# EAGLE schematic Nano-CC-EL_0v6.1_ENP252-17 (EAGLE 7.3.0)
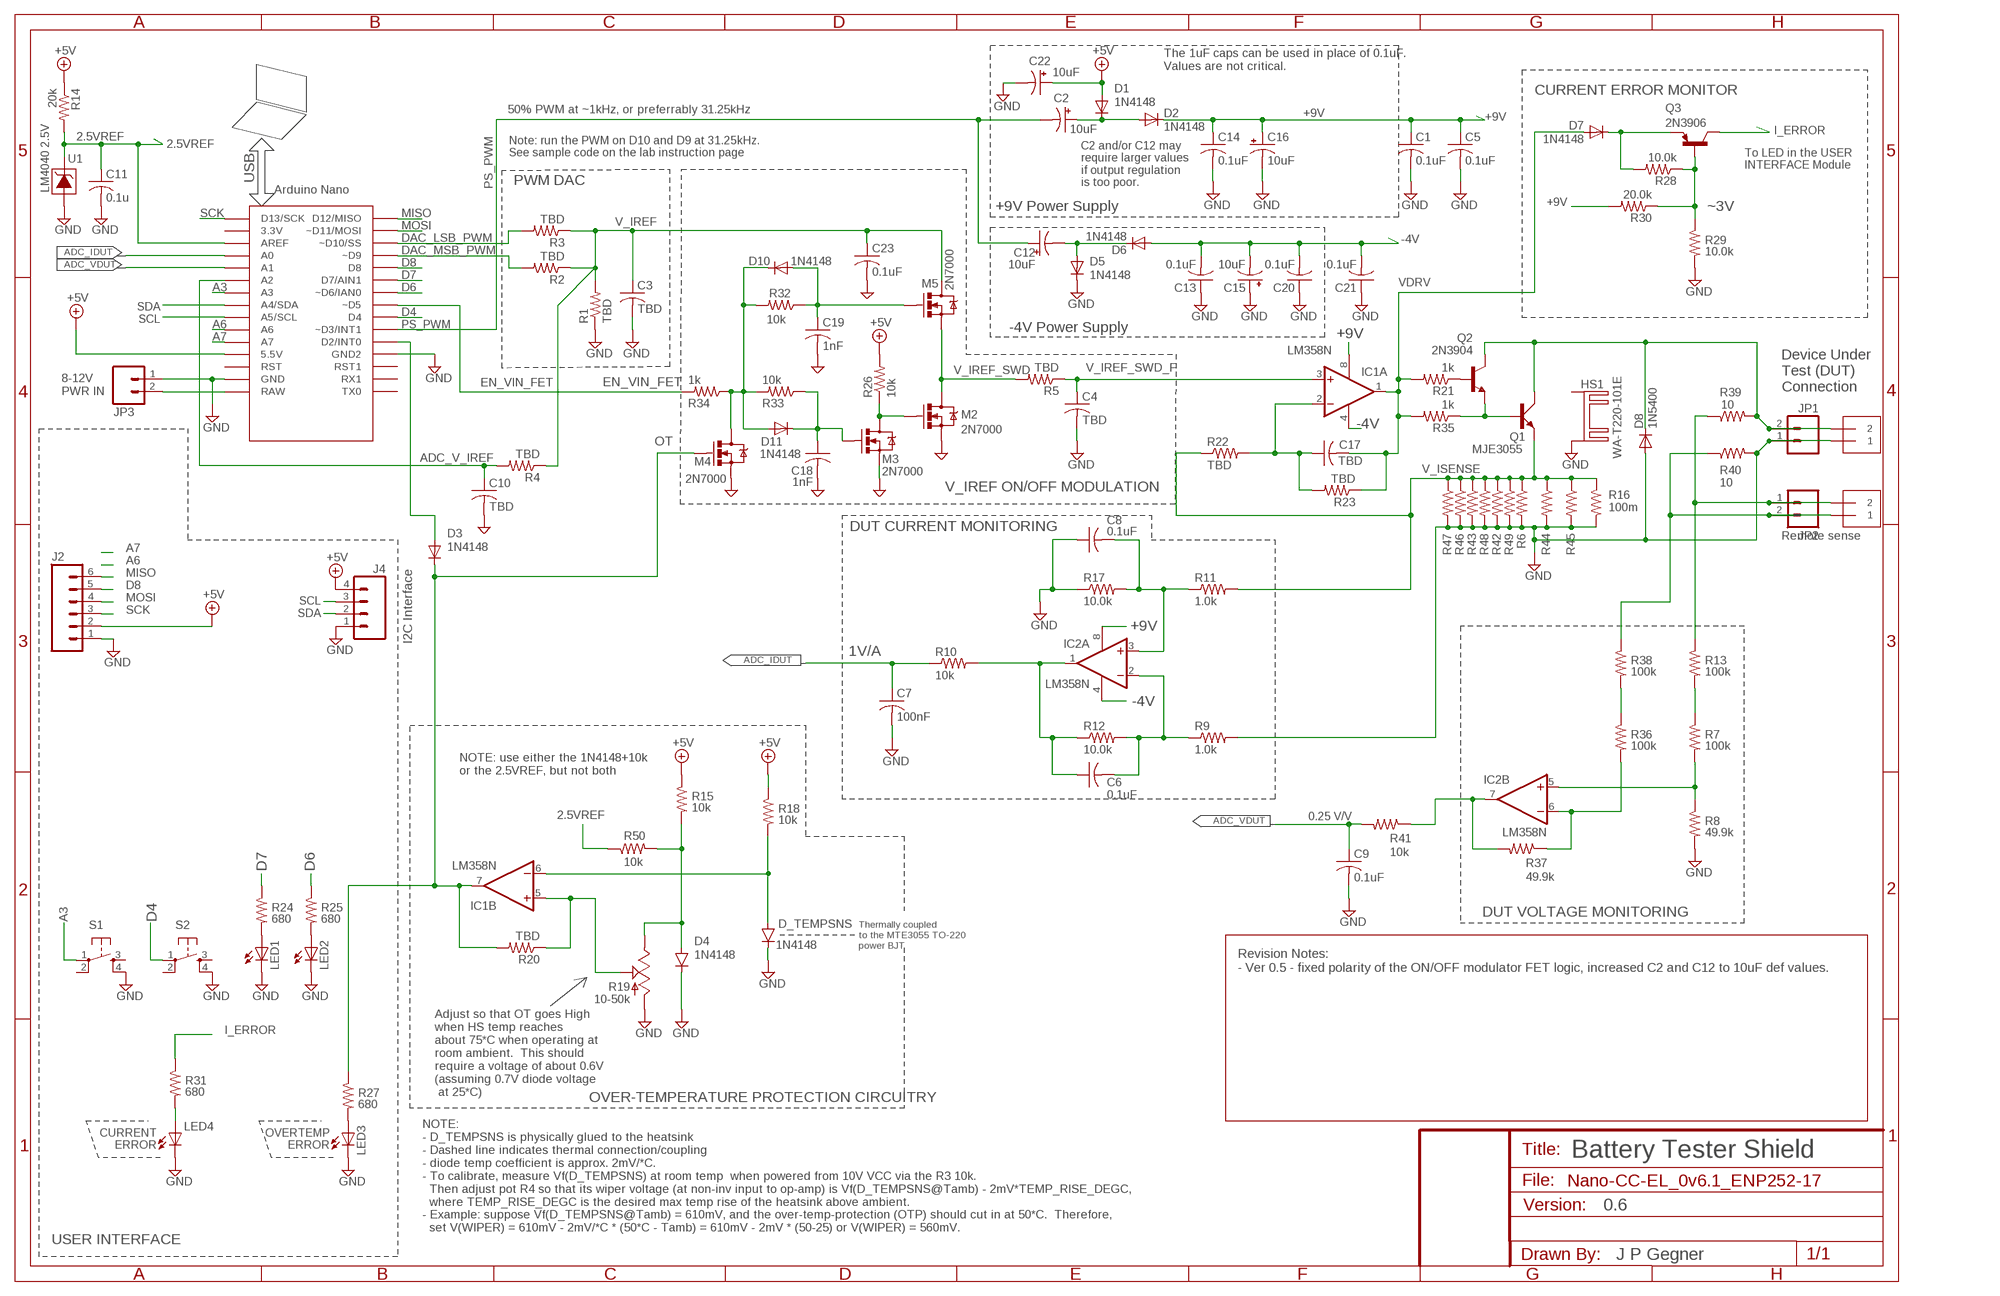
[diagram p0: schematic, sheet 1]

## Parts
C1  0.1uF  C-US025-025X050  [C025-025X050]
C2  10uF  CPOL-USE5-5  [E5-5]
C3  TBD  C-US025-025X050  [C025-025X050]
C4  TBD  C-US025-025X050  [C025-025X050]
C5  0.1uF  C-US025-025X050  [C025-025X050]
C6  0.1uF  C-US025-025X050  [C025-025X050]
C7  100nF  C-US025-024X044  [C025-024X044]
C8  0.1uF  C-US025-025X050  [C025-025X050]
C9  0.1uF  C-US025-025X050  [C025-025X050]
C10  TBD  C-US025-025X050  [C025-025X050]
C11  0.1u  C-US025-025X050  [C025-025X050]
C12  10uF  CPOL-USE5-5  [E5-5]
C13  0.1uF  C-US025-025X050  [C025-025X050]
C14  0.1uF  C-US025-025X050  [C025-025X050]
C15  10uF  CPOL-USE5-5  [E5-5]
C16  10uF  CPOL-USE5-5  [E5-5]
C17  TBD  C-US025-025X050  [C025-025X050]
C18  1nF  C-US025-025X050  [C025-025X050]
C19  1nF  C-US025-025X050  [C025-025X050]
C20  0.1uF  C-US025-025X050  [C025-025X050]
C21  0.1uF  C-US025-025X050  [C025-025X050]
C22  10uF  CPOL-USE5-5  [E5-5]
C23  0.1uF  C-US025-025X050  [C025-025X050]
D1  1N4148  [0207/2V-D]
D2  1N4148  [0207/2V-D]
D3  1N4148  [0207/2V-D]
D4  1N4148  [0207/2V-D]
D5  1N4148  [0207/2V-D]
D6  1N4148  [0207/2V-D]
D7  1N4148  [0207/2V-D]
D8  1N5400  [DO201-15]
D10  1N4148  [0207/2V-D]
D11  1N4148  [0207/2V-D]
D_TEMPSNS  1N4148  [0207/2V-D]
HS1  WA-T220-101E  [WX-T220-101E]
IC1  LM358N  [DIL08]
IC2  LM358N  [DIL08]
J2  M06POLAR  [MOLEX-1X6]
J4  M04LOCK_LONGPADS  [1X04_LOCK_LONGPADS]
JP1  M02PTH  [1X02]
JP2  M02PTH  [1X02]
JP3  M02PTH  [1X02]
JP4  1X2-3.5MM  [1X2-3.5MM]
JP5  1X2-3.5MM  [1X2-3.5MM]
LED1  LED-3MM-NO_SILK  [LED3MM-NS]
LED2  LED-3MM-NO_SILK  [LED3MM-NS]
LED3  LED-3MM-NO_SILK  [LED3MM-NS]
LED4  LED-3MM-NO_SILK  [LED3MM-NS]
M2  2N7000  MOSFET-NCHANNEL2N7000  [TO-92]
M3  2N7000  MOSFET-NCHANNEL2N7000  [TO-92]
M4  2N7000  MOSFET-NCHANNEL2N7000  [TO-92]
M5  2N7000  MOSFET-NCHANNEL2N7000  [TO-92]
Q1  MJE3055  [TO220AV]
Q2  2N3904  [TO92]
Q3  2N3906  [TO92]
R1  TBD  R-US_0204/7  [0204/7]
R2  TBD  R-US_0204/7  [0204/7]
R3  TBD  R-US_0204/7  [0204/7]
R4  TBD  R-US_0204/7  [0204/7]
R5  TBD  R-US_0204/2V  [0204V]
R6  100m  R-US_0204/7  [0204/7]
R7  100k  R-US_0204/7  [0204/7]
R8  49.9k  R-US_0204/7  [0204/7]
R9  1.0k  R-US_0204/7  [0204/7]
R10  10k  R-US_0204/7  [0204/7]
R11  1.0k  R-US_0204/7  [0204/7]
R12  10.0k  R-US_0204/2V  [0204V]
R13  100k  R-US_0204/7  [0204/7]
R14  20k  R-US_0204/7  [0204/7]
R15  10k  R-US_0204/7  [0204/7]
R16  100m  R-US_0204/7  [0204/7]
R17  10.0k  R-US_0204/7  [0204/7]
R18  10k  R-US_0204/7  [0204/7]
R19  10-50k  TRIM_US-B64Y  [B64Y]
R20  TBD  R-US_0204/7  [0204/7]
R21  1k  R-US_0204/7  [0204/7]
R22  TBD  R-US_0204/7  [0204/7]
R23  TBD  R-US_0204/2V  [0204V]
R24  680  R-US_0204/7  [0204/7]
R25  680  R-US_0204/7  [0204/7]
R26  10k  R-US_0204/7  [0204/7]
R27  680  R-US_0204/7  [0204/7]
R28  10.0k  R-US_0204/7  [0204/7]
R29  10.0k  R-US_0204/7  [0204/7]
R30  20.0k  R-US_0204/7  [0204/7]
R31  680  R-US_0204/7  [0204/7]
R32  10k  R-US_0204/7  [0204/7]
R33  10k  R-US_0204/7  [0204/7]
R34  1k  R-US_0204/2V  [0204V]
R35  1k  R-US_0204/7  [0204/7]
R36  100k  R-US_0204/7  [0204/7]
R37  49.9k  R-US_0204/2V  [0204V]
R38  100k  R-US_0204/7  [0204/7]
R39  10  R-US_0204/2V  [0204V]
R40  10  R-US_0204/2V  [0204V]
R41  10k  R-US_0204/7  [0204/7]
R42  100m  R-US_0204/7  [0204/7]
R43  100m  R-US_0204/7  [0204/7]
R44  100m  R-US_0204/7  [0204/7]
R45  100m  R-US_0204/7  [0204/7]
R46  100m  R-US_0204/7  [0204/7]
R47  100m  R-US_0204/7  [0204/7]
R48  100m  R-US_0204/7  [0204/7]
R49  100m  R-US_0204/7  [0204/7]
R50  10k  R-US_0204/7  [0204/7]
S1  E-SWITCH_TL1105L-F250-Q  [OMRON_B3F-1XX-JPGMOD]
S2  E-SWITCH_TL1105L-F250-Q  [OMRON_B3F-1XX-JPGMOD]
U1  LM4040 2.5V  LM4040TO92  [TO92]
U$1  NANO  [NANO]

## Nets
2.5VREF: C11.1 R14.2 R50.1 U1.2(CATHODE) U$1.AREF
+5V: C22.+ D1.A J2.2 J4.4 R14.1 R15.1 R18.1 R26.2 U$1.5V(5.5V)
+9V: C1.1 C5.1 C14.1 C16.+ D2.K(C) IC1.8(P:V+) IC2.8(P:V+) R30.2
-4V: C13.2 C15.- C20.2 C21.2 D6.A IC1.4(P:V-) IC2.4(P:V-)
A3: S1.1(P) U$1.A3
A6: U$1.A6
A7: U$1.A7
ADC_IDUT: C7.1 R10.1 U$1.A0
ADC_V_IREF: C10.1 R4.2 U$1.A2
ADC_VDUT: C9.1 R41.2 U$1.A1
D4: S2.1(P) U$1.D4
D6: R25.1 U$1.D6(~D6/IAN0)
D7: R24.1 U$1.D7(D7/AIN1)
D8: J2.5 U$1.D8
DAC_LSB_PWM: R3.2 U$1.D10(~D10/SS)
DAC_MSB_PWM: R2.2 U$1.D9(~D9)
EN_VIN_FET: R34.2 U$1.D5(~D5)
EN_VIN_FETX: D10.K(C) D11.A M4.3(D) R32.2 R33.2 R34.1
GND: C1.2 C3.2 C4.2 C5.2 C7.2 C8.1 C9.2 C10.2 C11.2 C13.1 C14.2 C15.+ C16.- C18.2 C19.2 C20.1 C21.1 C22.- C23.2 D4.K(C) D5.K(C) D8.A D_TEMPSNS.K(C) HS1.K2(K) J2.1 J4.1 JP1.1 JP3.1 JP5.1 LED1.K(C) LED2.K(C) LED3.K(C) LED4.K(C) M2.1(S) M3.1(S) M4.1(S) R1.1 R6.2 R8.2 R9.2 R16.2 R17.1 R19.A R29.2 R40.2 R42.2 R43.2 R44.2 R45.2 R46.2 R47.2 R48.2 R49.2 S1.4(S1) S2.4(S1) U1.3(ANODE) U$1.GND U$1.GND1(GND2)
I_ERROR: Q3.1(C) R31.1
MISO: J2.6 U$1.D12(D12/MISO)
MOSI: J2.4 U$1.D11(~D11/MOSI)
N$1: D4.A R15.2 R19.E R50.2
N$2: R7.1 R13.2
N$3: C8.2 IC2.3(A:+IN) R11.1 R17.2
N$4: C6.2 IC2.2(A:-IN) R9.1 R12.2
N$5: D_TEMPSNS.A IC1.6(B:-IN) R18.2
N$6: IC1.5(B:+IN) R19.S R20.1
N$8: C19.1 D10.A M5.2(G) R32.1
N$9: D7.K(C) Q3.3(E) R28.2
N$10: IC2.6(B:-IN) R36.2 R37.1
N$11: C12.- D5.A D6.K(C)
N$12: LED3.A R27.2
N$13: LED1.A R24.2
N$14: LED2.A R25.2
N$15: C6.1 IC2.1(A:OUT) R10.2 R12.1
N$16: LED4.A R31.2
N$17: Q3.2(B) R28.1 R29.1 R30.1
N$18: C2.+ D1.K(C) D2.A
N$19: IC2.5(B:+IN) R7.2 R8.1
N$20: C18.1 D11.K(C) M3.2(G) R33.1
N$21: M2.2(G) M3.3(D) R26.1
N$22: JP2.1 JP4.2 R13.1 R39.1
N$23: D3.A U$1.D2(D2/INT0)
N$24: Q2.2(B) R21.1
N$25: D8.C JP1.2 JP5.2 Q1.C Q2.1(C) R39.2
N$26: Q1.B Q2.3(E) R35.1
N$27: R36.1 R38.2
N$28: C17.1 IC1.2(A:-IN) R22.2 R23.2
N$29: JP2.2 JP4.1 R38.1 R40.1
OT: D3.K(C) IC1.7(B:OUT) M4.2(G) R20.2 R27.1
PS_PWM: C2.- C12.+ U$1.D3(~D3/INT1)
RAW: JP3.2 U$1.RAW
SCK: J2.3 U$1.D13(D13/SCK)
SCL: J4.3 U$1.A5(A5/SCL)
SDA: J4.2 U$1.A4(A4/SDA)
V_IREF: C3.1 C23.1 M5.3(D) R1.2 R2.1 R3.1 R4.1
V_IREF_SWD: M2.3(D) M5.1(S) R5.2
V_IREF_SWD_F: C4.1 IC1.3(A:+IN) R5.1
V_ISENSE: Q1.E R6.1 R11.2 R16.1 R22.1 R42.1 R43.1 R44.1 R45.1 R46.1 R47.1 R48.1 R49.1
VDRV: C17.2 D7.A IC1.1(A:OUT) R21.2 R23.1 R35.2
VDUT_OP: IC2.7(B:OUT) R37.2 R41.1
Unconnected: HS1.K1(K) S1.2(P1) S1.3(S) S2.2(P1) S2.3(S) U$1.3.3V U$1.ICSP1 U$1.ICSP2 U$1.ICSP3 U$1.ICSP4 U$1.ICSP5 U$1.ICSP6 U$1.RST U$1.RST1 U$1.RX1 U$1.TX0

## Notes on the sheet
- The 1uF caps can be used in place of 0.1uF.
  Values are not critical.
- CURRENT ERROR MONITOR
- 50% PWM at ~1kHz, or preferrably 31.25kHz
- Note: run the PWM on D10 and D9 at 31.25kHz.  
  See sample code on the lab instruction page
- To LED in the USER
  INTERFACE Module
- USB | PWM DAC
- C2 and/or C12 may
  require larger values
  if output regulation
  is too poor.
- +9V Power Supply | ~3V
- -4V Power Supply
- Device Under
  Test (DUT)
  Connection
- 8-12V
  PWR IN
- V_IREF ON/OFF MODULATION
- DUT CURRENT MONITORING
- Remote sense
- I2C Interface
- 1V/A
- NOTE: use either the 1N4148+10k
  or the 2.5VREF, but not both
- 0.25 V/V
- DUT VOLTAGE MONITORING
- Thermally coupled
  to the MTE3055 TO-220 
  power BJT
- Revision Notes:
  - Ver 0.5 - fixed polarity of the ON/OFF modulator FET logic, increased C2 and C12 to 10uF def values.
- Adjust so that OT goes High
  when HS temp reaches
  about 75*C when operating at 
  room ambient.  This should
  require a voltage of about 0.6V
  (assuming 0.7V diode voltage
   at 25*C)
- OVER-TEMPERATURE PROTECTION CIRCUITRY
- CURRENT
  ERROR
- OVERTEMP
  ERROR
- Battery Tester Shield
- 0.6
- NOTE:
  - D_TEMPSNS is physically glued to the heatsink
  - Dashed line indicates thermal connection/coupling
  - diode temp coefficient is approx. 2mV/*C.
  - To calibrate, measure Vf(D_TEMPSNS) at room temp  when powered from 10V VCC via the R3 10k.
    Then adjust pot R4 so that its wiper voltage (at non-inv input to op-amp) is Vf(D_TEMPSNS@Tamb) - 2mV*TEMP_RISE_DEGC,
    where TEMP_RISE_DEGC is the desired max temp rise of the heatsink above ambient.  
  - Example: suppose Vf(D_TEMPSNS@Tamb) = 610mV, and the over-temp-protection (OTP) should cut in at 50*C.  Therefore,
    set V(WIPER) = 610mV - 2mV/*C * (50*C - Tamb) = 610mV - 2mV * (50-25) or V(WIPER) = 560mV.
- USER INTERFACE
- J P Gegner

## Library data of the parts
C1 C3-C11 C13 C14 C17-C21 C23 = rcl:C-US: CAPACITOR, American symbol
C2 C12 C15 C16 C22 = rcl:CPOL-US: POLARIZED CAPACITOR, American symbol
D1-D3 D5-D7 D10 D11 = JPG_17v2:1N4148
D4 D_TEMPSNS = ideal_elements:1N4148
D8 = diode:1N5400: DIODE standard rectifier, 3 A, 50 V (Motorola)
HS1 = JPG_17v2:WA-T220-101E: Ohmite W series Heatsink for TO-220, 12 degC/W natural convection at 10W WA-T220-101E WV-T220-101E see also a T247 version
IC1 IC2 = linear:LM358: OP AMP also LM158; LM258; LM2904 Source: http://cache.national.com/ds/LM/LM158.pdf
J2 = JPG_17v2:M06: Header 6 Standard 6-pin 0.1" header. Use with straight break away headers (SKU : PRT-00116), right angle break away headers (PRT-00553), swiss pins (PRT-00743), machine pins (PRT-00117), and female headers (PRT-00115). Molex polarized connector foot print use with SKU : PRT-08094 with associated crimp pins and housings. NOTES ON THE VARIANTS LOCK and LOCK_LONGPADS... This footprint was designed to help hold the alignment of a through-hole component (i.e. 6-pin header) while soldering it into place. You may notice that each hole has been shifted either up or down by 0.005 of an inch from it's more standard position (which is a perfectly straight line). This slight alteration caused the pins (the squares in the middle) to touch the edges of the holes. Because they are alternating, it causes a "brace" to hold the component in place. 0.005 has proven to be the perfect amount of "off-center" position when using our standard breakaway headers. Although looks a little odd when you look at the bare footprint, once you have a header in there, the alteration is very hard to notice. Also,if you push a header all the way into place, it is covered up entirely on the bottom side. This idea of altering the position of holes to aid alignment will be further integrated into the Sparkfun Library for other footprints. It can help hold any component with 3 or more connection pins.
J4 = JPG_17v2:M04: Header 4 Standard 4-pin 0.1" header. Use with straight break away headers (SKU : PRT-00116), right angle break away headers (PRT-00553), swiss pins (PRT-00743), machine pins (PRT-00117), and female headers (PRT-00115). Molex polarized connector foot print use with SKU : PRT-08231 with associated crimp pins and housings. 1MM SMD Version SKU: PRT-10208; PROD_ID: CONN-09696
JP1-JP3 = JPG_17v1:M02: Header 2 Standard 2-pin 0.1" header. Use with straight break away headers (SKU : PRT-00116), right angle break away headers (PRT-00553), swiss pins (PRT-00743), machine pins (PRT-00117), and female headers (PRT-00115). Molex polarized connector foot print use with SKU : PRT-08233 with associated crimp pins and housings.
JP4 JP5 = adafruit:1X2: 3.5mm Terminal block http://www.ladyada.net/library/pcb/eaglelibrary.html
LED1-LED4 = JPG_17v2:LED: LEDs Standard schematic elements and footprints for 5mm, 3mm, 1206, and 0603 sized LEDs. 5mm - Spark Fun Electronics SKU : COM-00529 (and others)
M2-M5 = SparkFun-DiscreteSemi:MOSFET-NCHANNEL: Common NMOSFET Parts MFG P/N Store ID Prod ID FDD8780 TRANS-09984 SI7820DN TRANS-11055 FDS6630A IC-08089 2N7002PW TRANS-11151 FQP30N06L COM-10213 TRANS-10060 BSS123LT1G TRANS-08345 BSS138 TRANS-00830 BS170 2N7000
Q1 = transistor-power:MJE3055: NPN TRANSISTOR
Q2 = transistor:2N3904: NPN TRANSISTOR
Q3 = transistor-pnp:2N3906: PNP Transistor
R1-R18 R20-R50 = rcl:R-US_: RESISTOR, American symbol
R19 = JPG_17v1:TRIM_US-: POTENTIOMETER
S1 S2 = ideal_elements:E-SWITCH_TL1105L-F250-Q: PC MOUNT TACTILE MOMENTARY SWITCH (LOW COST, MOUSER)
U1 = JPG_17v1:LM4040
U$1 = Arduino-clone:NANO: Arduino Nano